# Altium schematic sheet 3-Wifi-SD.SchDoc
size A4; SheetNumber: 3; SheetTotal: 4
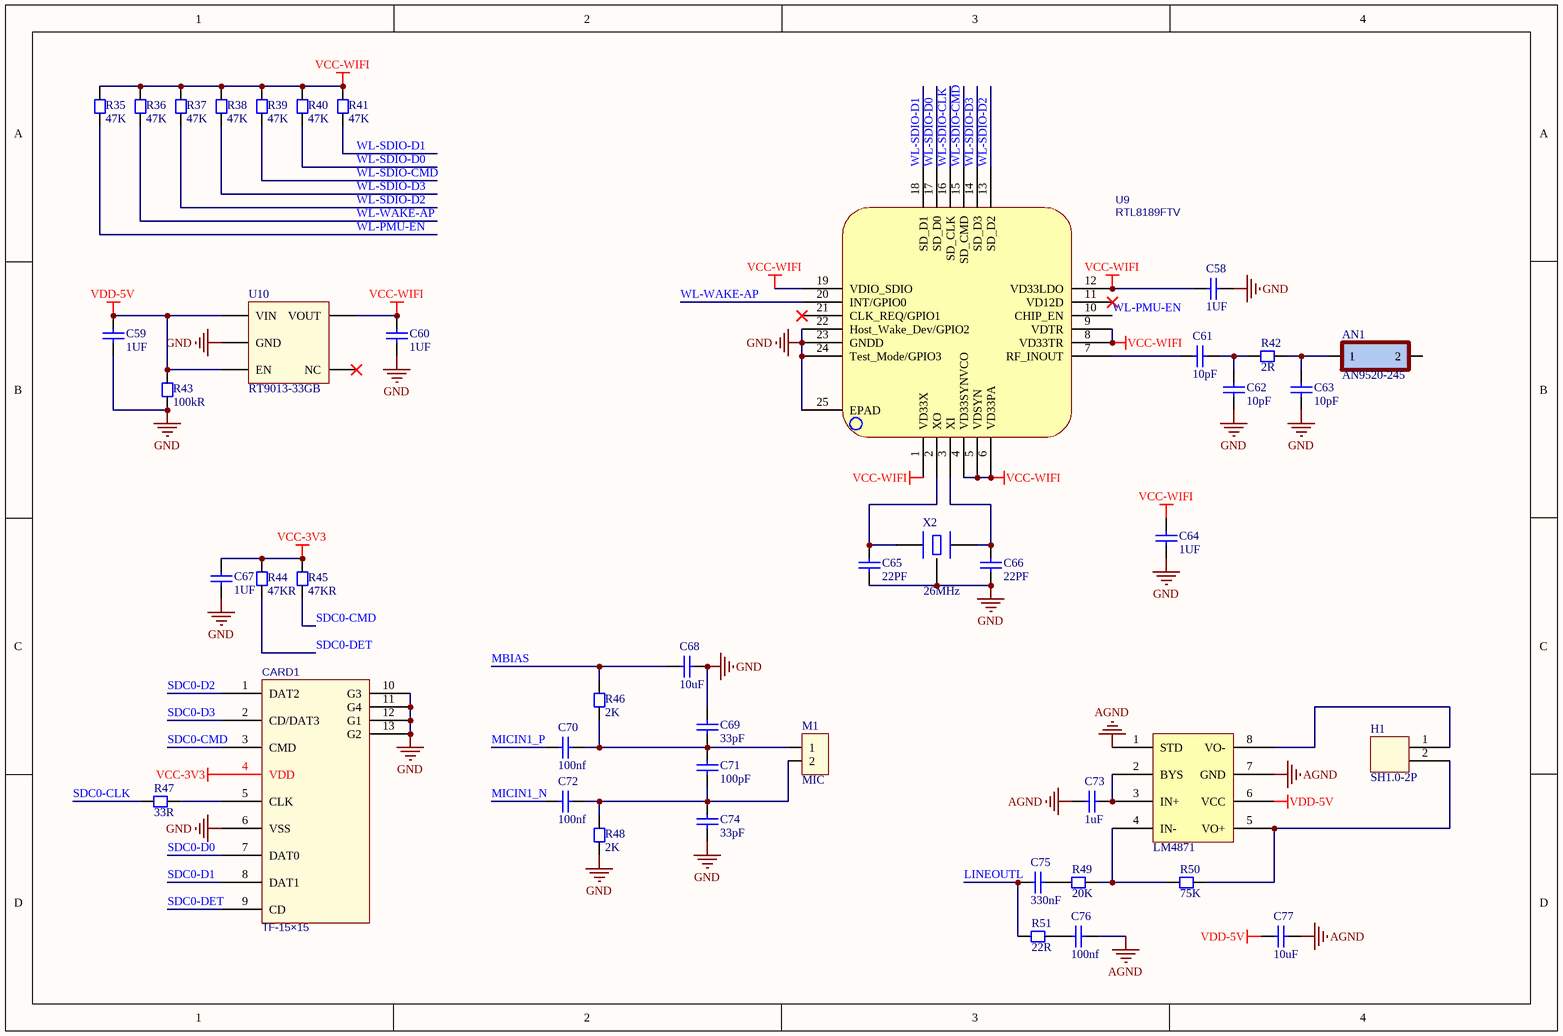
[diagram p0: 3-Wifi-SD.SchDoc]

## Parts
AN1  AN9520-245  [AN-5120]
C58  1UF  [CC1005-0402]
C59  1UF  [CC1005-0402]
C60  1UF  [CC1005-0402]
C61  10pF  [CC1005-0402]
C62  10pF  [CC1005-0402]
C63  10pF  [CC1005-0402]
C64  1UF  [CC1005-0402]
C65  22PF  [CC1005-0402]
C66  22PF  [CC1005-0402]
C67  1UF  [CC1005-0402]
C68  10uF  [CC1608-0603]
C69  33pF  [CC1005-0402]
C70  100nf  [CC1005-0402]
C71  100pF  [CC1005-0402]
C72  100nf  [CC1005-0402]
C73  1uF  [CC1005-0402]
C74  33pF  [CC1005-0402]
C75  330nF  [CC1005-0402]
C76  100nf  [CC1005-0402]
C77  10uF  [CC1608-0603]
CARD1  TF-15×15  [TF-SMD_TF-15-15]
H1  SH1.0-2P  [SH1.0-2P]
M1  MIC  [MIC6*2.2mm]
R35  47K  [CR1005-0402]
R36  47K  [CR1005-0402]
R37  47K  [CR1005-0402]
R38  47K  [CR1005-0402]
R39  47K  [CR1005-0402]
R40  47K  [CR1005-0402]
R41  47K  [CR1005-0402]
R42  2R  [CR1005-0402]
R43  100kR  [CR1005-0402]
R44  47KR  [CR1005-0402]
R45  47KR  [CR1005-0402]
R46  2K  [CR1005-0402]
R47  33R  [CR1005-0402]
R48  2K  [CR1005-0402]
R49  20K  [CR1005-0402]
R50  75K  [CR1005-0402]
R51  22R  [CR1005-0402]
U0  LM4871  [MSOP-8]
U9  RTL8189FTV  [QFN24-0404-.5]
U10  RT9013-33GB  [SOT23-5]
X2  26MHz  [XTAL-3225]

## Nets
AGND: C73.1 C76.1 C77.1 U0.1(STD) U0.7(GND)
GND: C58.2 C59.2 C60.2 C62.2 C63.2 C64.2 C65.1 C66.1 C67.2 C68.1 C69.1 C74.2 CARD1.6(VSS) CARD1.10(G3) CARD1.11(G4) CARD1.12(G1) CARD1.13(G2) R43.1 R48.1 U9.22(Host_Wake_Dev/GPIO2) U9.23(GNDD) U9.24(Test_Mode/GPIO3) U9.25(EPAD) U10.2(GND) X2.2(GND)
VCC-3V3: C67.1 CARD1.4(VDD) R44.2 R45.2
VCC-WIFI: C58.1 C60.1 C64.1 R35.2 R36.2 R37.2 R38.2 R39.2 R40.2 R41.2 U9.1(VD33X) U9.4(VD33SYNVCO) U9.5(VDSYN) U9.6(VD33PA) U9.8(VD33TR) U9.9(VDTR) U9.12(VD33LDO) U9.19(VDIO_SDIO) U10.5(VOUT)
VDD-5V: C59.1 C77.2 R43.2 U0.6(VCC) U10.1(VIN) U10.3(EN)
LINEOUTL: C75.1 R51.1
MBIAS: C68.2 R46.2
MICIN1_N: C72.2
MICIN1_P: C70.2
SDC0-CLK: R47.2
SDC0-CMD: CARD1.3(CMD) R45.1
SDC0-D0: CARD1.7(DAT0)
SDC0-D1: CARD1.8(DAT1)
SDC0-D2: CARD1.1(DAT2)
SDC0-D3: CARD1.2(CD/DAT3)
SDC0-DET: CARD1.9(CD) R44.1
WL-PMU-EN: R35.1 U9.10(CHIP_EN)
WL-SDIO-CLK: U9.16(SD_CLK)
WL-SDIO-CMD: R39.1 U9.15(SD_CMD)
WL-SDIO-D0: R40.1 U9.17(SD_D0)
WL-SDIO-D1: R41.1 U9.18(SD_D1)
WL-SDIO-D2: R37.1 U9.13(SD_D2)
WL-SDIO-D3: R38.1 U9.14(SD_D3)
WL-WAKE-AP: R36.1 U9.20(INT/GPIO0)
NetAN1_1: AN1.1 C63.1 R42.2
NetC61_1: C61.1 C62.1 R42.1
NetC61_2: C61.2 U9.7(RF_INOUT)
NetC65_2: C65.2 U9.2(XO) X2.1(OSC1)
NetC66_2: C66.2 U9.3(XI) X2.3(OSC2)
NetC69_2: C69.2 C70.1 C71.1 M1.1 R46.1
NetC71_2: C71.2 C72.1 C74.1 M1.2 R48.2
NetC73_2: C73.2 U0.2(BYS) U0.3(IN+)
NetC75_2: C75.2 R49.2
NetC76_2: C76.2 R51.2
NetCARD1_5: CARD1.5(CLK) R47.1
NetH1_1: H1.1 U0.8(VO-)
NetH1_2: H1.2 R50.1 U0.5(VO+)
NetR49_1: R49.1 R50.2 U0.4(IN-)

Not connected (* = marked no-connect by the designer): AN1 2; U9 11(VD12D)* 21(CLK_REQ/GPIO1)*; U10 4(NC)*

## Library data of the parts
AN1 = AN9520-245: 2.4G全向天线 蓝牙天线 陶瓷贴片 WIFI内置
C58-C77 = Chip capacitor: 贴片电容
CARD1 = TF-15×15: TF卡卡座 https://item.szlcsc.com/112422.html; BOM_Manufacturer: SOFNG; BOM_Supplier: LCSC; BOM_Manufacturer Part: TF-15×15; BOM_Supplier Part: C111196; BOM_JLCPCB Part Class: Extended Part; spicePre: C; spiceSymbolName: TF-15×15
M1 = MIC: 驻体麦克风
R35-R51 = Chip resistor: 贴片电阻
U0 = LM4871: 单通道音频放大器
U9 = RTL8189FTV: Contributor: Pythoniot; spicePre: U; spiceSymbolName: RTL8189FTV
U10 = RT9013-33GB: LDO 2.2-5.2V IN 500Ma OUT SOT23-5
X2 = XTAL 3225: 3225封装的晶振